# EAGLE design USB_Isolator_v1p00 (EAGLE 9.6.2)
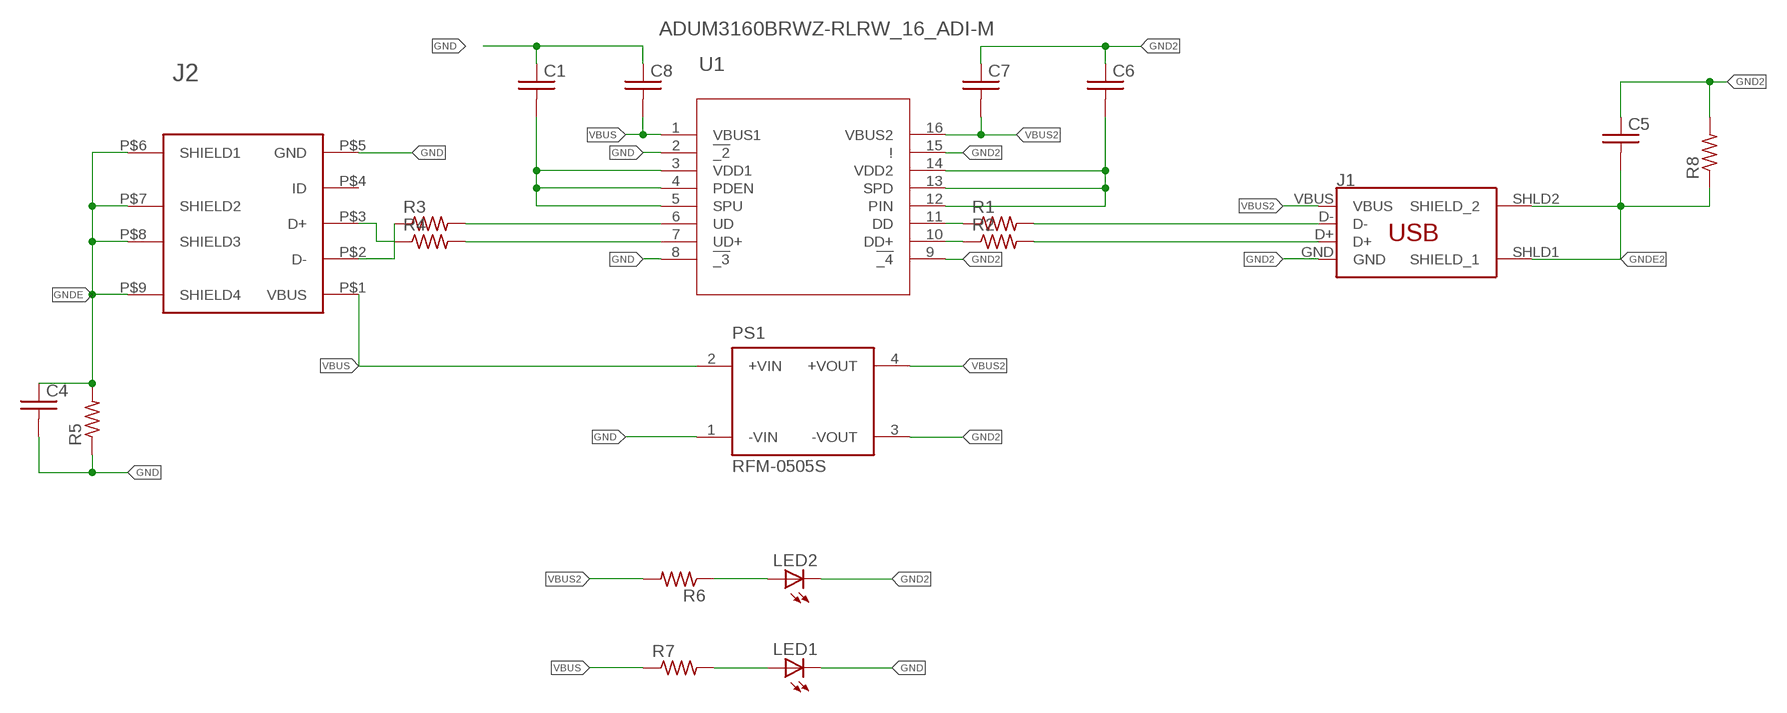
[diagram p0: schematic, sheet 1]

## Parts
C1  C_0402  [0402]
C4  C_0402  [0402]
C5  C_0402  [0402]
C6  C_0402  [0402]
C7  C_0402  [0402]
C8  C_0402  [0402]
J1  USB_A  [USB_A_SMT]
J2  USB_MICRO-B  [USB_MICRO-B]
LED1  LED_0805_GREEN  [LED_0805_GREEN]
LED2  LED_0805_GREEN  [LED_0805_GREEN]
PS1  RFM-0505S  [CONV_RFM-0505S]
R1  R_0402  [0402]
R2  R_0402  [0402]
R3  R_0402  [0402]
R4  R_0402  [0402]
R5  R_0402  [0402]
R6  R_0402  [0402]
R7  R_0402  [0402]
R8  R_0402  [0402]
U1  ADUM3160BRWZ-RLRW_16_ADI-M  [RW_16_ADI-M]

## Nets
GND: C1.P$1 C4.P$2 C8.P$1 J2.P$5(GND) LED1.C PS1.1(-VIN) R5.P$1 U1.2(!_2) U1.8(!_3)
GND2: C5.P$1 C6.P$1 C7.P$1 J1.GND LED2.C PS1.3(-VOUT) R8.P$2 U1.9(!_4) U1.15(!)
GNDE: C4.P$1 J2.P$6(SHIELD1) J2.P$7(SHIELD2) J2.P$8(SHIELD3) J2.P$9(SHIELD4) R5.P$2
GNDE2: C5.P$2 J1.SHLD1(SHIELD_1) J1.SHLD2(SHIELD_2) R8.P$1
N$1: R3.P$2 U1.6(UD)
N$2: R4.P$2 U1.7(UD+)
N$3: R1.P$1 U1.11(DD)
N$4: R2.P$1 U1.10(DD+)
N$5: J2.P$3(D+) R4.P$1
N$6: J2.P$2(D-) R3.P$1
N$7: LED2.A R6.P$1
N$8: J1.D+ R2.P$2
N$9: J1.D- R1.P$2
N$10: C6.P$2 U1.12(PIN) U1.13(SPD) U1.14(VDD2)
N$11: C1.P$2 U1.3(VDD1) U1.4(PDEN) U1.5(SPU)
N$12: LED1.A R7.P$2
VBUS: C8.P$2 J2.P$1(VBUS) PS1.2(+VIN) R7.P$1 U1.1(VBUS1)
VBUS2: C7.P$2 J1.VBUS PS1.4(+VOUT) R6.P$2 U1.16(VBUS2)
Unconnected: J2.P$4(ID)

## Library data of the parts
C1 C4-C8 = 3D_MIG_Controller:C_0402
J1 = 3D_MIG_Controller:USB_A: USB-A Connector Male and female variants, as well as PTH and SMT variants SparkFun Products: SparkFun XBee Explorer Dongle <https://www.sparkfun.com/products/11697> PTH Male SparkFun MicroView-USB Programmer <https://www.sparkfun.com/products/12924> SMT Male SparkFun USB Type A Female Breakout <https://www.sparkfun.com/products/12700> SMT Female
J2 = 3D_MIG_Controller:USB_MICRO-B
LED1 LED2 = 3D_MIG_Controller:LED_0805_GREEN
PS1 = 3D_MIG_Controller:RFM-0505S: DC/DC Converter, 1 Watt, SIP4, Single Output; DESCRIPTION: 1W DC/DC-Converter 'ECONOLINE' SIP4 1kV unreg; DIGI-KEY_PART_NUMBER: 945-3159-ND; DIGIKEY-PURCHASE-URL: https://snapeda.com/shop?store=DigiKey&id=2771046; MF: Recom Power; MOUSER-PURCHASE-URL: https://snapeda.com/shop?store=Mouser&id=2771046; MP: RFM-0505S; PACKAGE: SIP-4 Recom Power
R1-R8 = 3D_MIG_Controller:R_0402
U1 = 3D_MIG_Controller:ADUM3160BRWZ-RL; BUILT_BY: EMA_UL_Team; COPYRIGHT: Copyright (C) 2018 Accelerated Designs. All rights reserved; MANUFACTURER_PART_NUMBER: ADUM3160BRWZ-RL; SOURCELIBRARY: Analog_2019-03-08; VENDOR: Analog Devices Inc

## Board
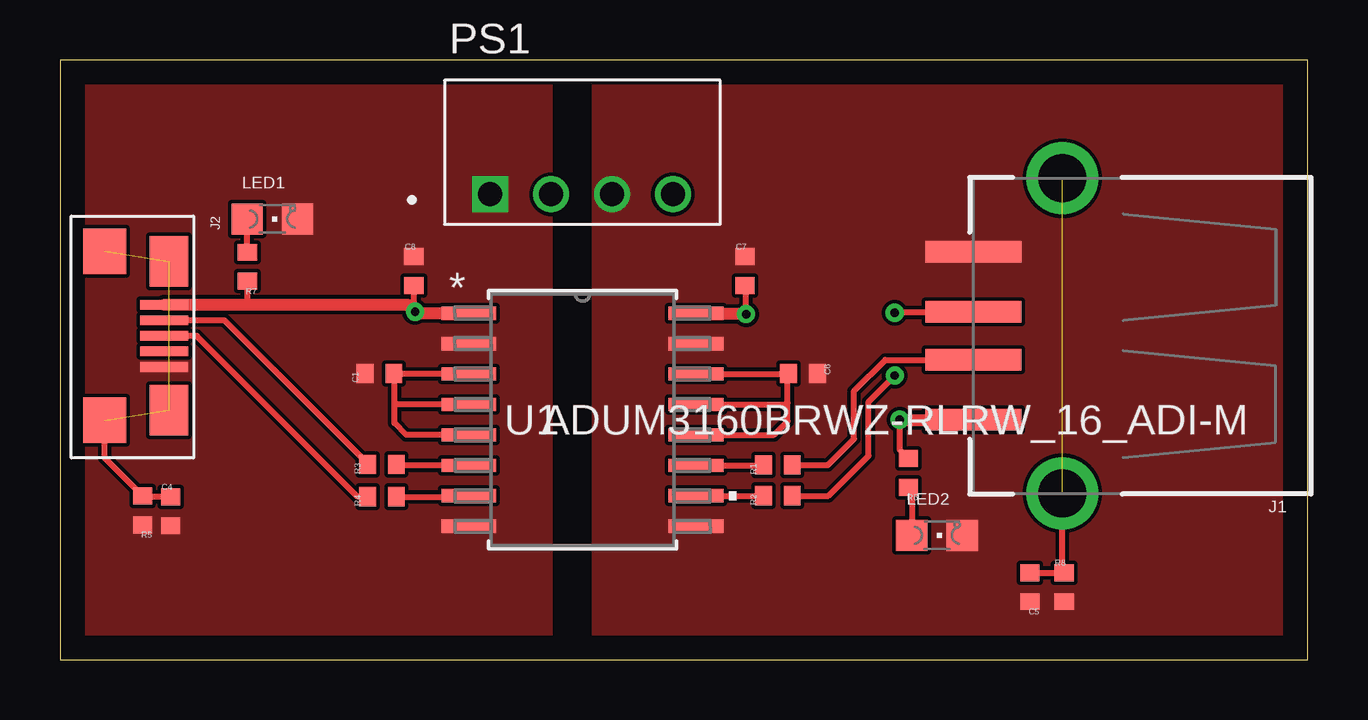
[diagram p1: board, top side]
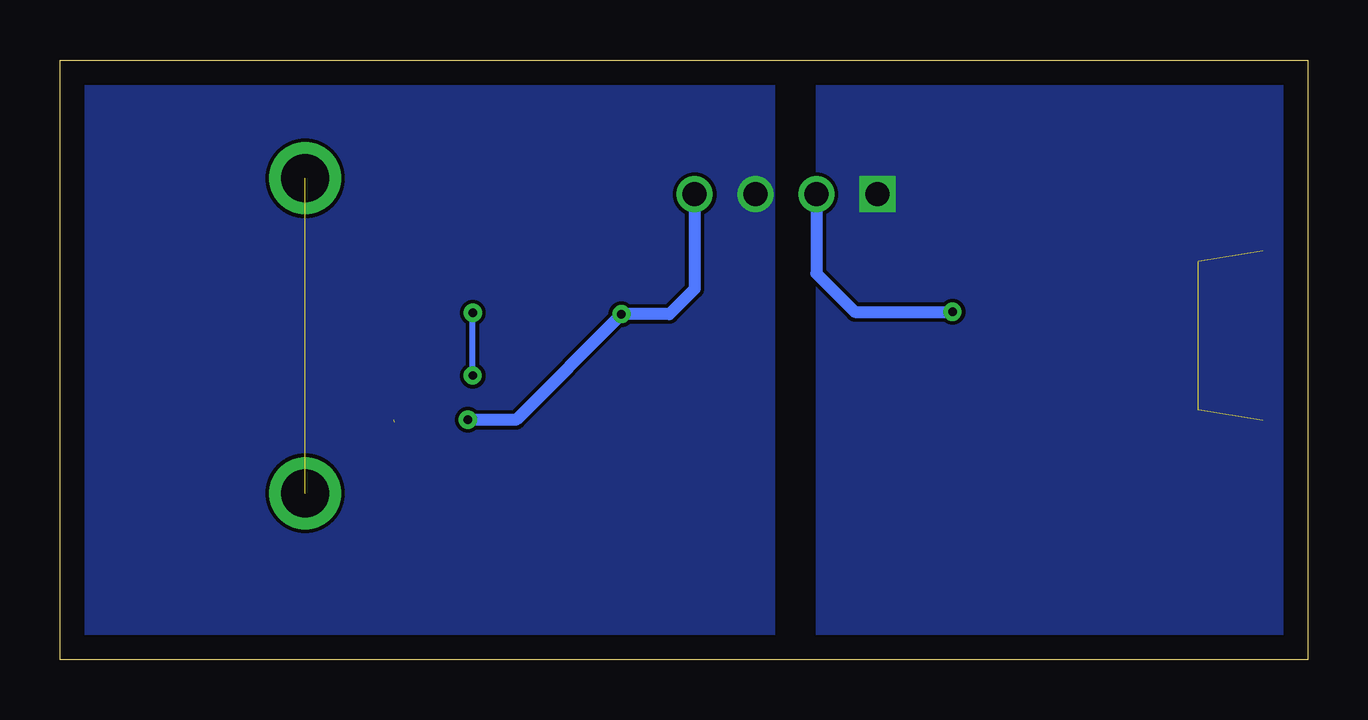
[diagram p2: board, bottom side, seen from below]

Size 52 x 25 mm. Coordinates in mm from the lower left corner, seen from the top.
Outline: 0,0 52,0 52,25 0,25 0,0
Copper layers (1*16): Top 0.035mm / dielectric 1.5mm / Bottom 0.035mm
Design rules "default": minimum track width 6mil, minimum drill 0.35mm, track to track 6mil, track to pad 6mil, pad to pad 6mil, via to via 6mil, smd to smd 6mil, copper to edge 40mil, drill to drill 6mil, minimum pad ring 10mil, minimum via ring 8mil, stop-mask expansion 4mil, vias tented up to drill 0mil, thermal gap 10mil

### Footprints (pad centres in the part's own frame; a part is rotated, then mirrored left to right if it is on the bottom)
0402 = smd 0.8 x 0.7: P$1 0,0.6; P$2 0,-0.6
USB_A_SMT = smd 4 x 0.9: D+ 6.7,-1; D- 6.7,1; GND 6.7,-3.5; VBUS 6.7,3.5 | drill 2: SHLD1 3,-6.566; SHLD2 3,6.566
USB_MICRO-B = smd 0.4 x 2: P$1 -1.3,2.475; P$2 -0.65,2.475; P$3 0,2.475; P$4 0.65,2.475; P$5 1.3,2.475 | smd 2.1 x 1.6: P$6 -3.1,2.675; P$7 3.1,2.675 | smd 1.9 x 1.8: P$8 -3.525,0; P$9 3.525,0
LED_0805_GREEN = smd 1.3 x 1.3: A 0,-1.05; C 0,1.05
CONV_RFM-0505S = drill 1 square: 1 -3.85,-1.75 | drill 1: 2 -1.31,-1.75; 3 1.23,-1.75; 4 3.77,-1.75
RW_16_ADI-M = smd 2.286 x 0.559: 1 -4.737,4.445; 2 -4.737,3.175; 3 -4.737,1.905; 4 -4.737,0.635; 5 -4.737,-0.635; 6 -4.737,-1.905; 7 -4.737,-3.175; 8 -4.737,-4.445; 9 4.737,-4.445; 10 4.737,-3.175; 11 4.737,-1.905; 12 4.737,-0.635; 13 4.737,0.635; 14 4.737,1.905; 15 4.737,3.175; 16 4.737,4.445

### Placement (x,y rotation side)
C1  13.32,11.93 90 top
C4  4.61,6.18 0 top
C5  40.43,3.02 180 top
C6  30.97,11.93 270 top
C7  28.55,16.2 0 top
C8  14.75,16.2 0 top
J1  44.78,13.5 180 top
J2  1.87,13.5 270 top
LED1  8.85,18.37 270 top
LED2  36.55,5.18 270 top
PS1  21.78,21.15 0 top
R1  29.92,8.11 90 top
R2  29.92,6.83 90 top
R3  13.42,8.13 90 top
R4  13.42,6.79 90 top
R5  3.45,6.22 180 top
R6  35.37,7.78 180 top
R7  7.81,16.38 180 top
R8  41.85,3.02 0 top
U1  21.78,10 0 top

### Tracks (layer width: path | path; a pad name or v marks a point on that pad's centre or on a via)
GND
  pour Top (no thermals): 0,25 20.5,25 20.5,0 0,0
  pour Bottom (no thermals): 0,25 20.5,25 20.5,0 0,0
GND2
  pour Top (no thermals): 52,25 52,0 22.2,0 22.2,25
  pour Bottom (no thermals): 22.2,25 52,25 52,0 22.2,0
GNDE  (3 unrouted)
  Top 0.254: C4.P$1 3.49,6.78 R5.P$2 1.87,8.4 J2.P$9
GNDE2  (1 unrouted)
  Top 0.254: C5.P$2 R8.P$1 41.78,3.69 J1.SHLD2
N$1
  Top 0.254: U1.6 14.05,8.1 R3.P$2
N$2
  Top 0.254: R4.P$2 17.01,6.79 U1.7
N$3
  Top 0.254: U1.11 29.3,8.1 R1.P$1
N$4
  Top 0.254: U1.10 R2.P$1
N$5
  Top 0.254: R4.P$1 12.41,6.79 5.7,13.5 J2.P$3
N$6
  Top 0.254: J2.P$2 6.85,14.15 12.82,8.18 R3.P$1
N$7
  Top 0.254: R6.P$1 35.5,7.05 LED2.A
N$8  (via drill 0.35)
  Top 0.254: R2.P$2 32.03,6.83 33.7,8.5 33.7,10.74 v34.8,11.84 | J1.D+ 38.04,14.46 v34.79,14.46
  Bottom 0.254: v34.8,11.84 v34.8,14.45 v34.79,14.46
N$9
  Top 0.254: 37.98,12.24 J1.D- 34.4,12.5 33.1,11.2 33.1,9.2 32.01,8.11 R1.P$2
N$10
  Top 0.254: U1.12 29.77,9.37 30.33,9.93 30.33,10.7 | 30.33,10.7 30.33,11.9 | 30.33,11.9 C6.P$2 | U1.13 30.27,10.63 30.33,10.7 | U1.14 30.32,11.9 30.33,11.9
N$11
  Top 0.254: U1.3 13.95,11.9 | 13.95,11.9 C1.P$2 | U1.5 14.44,9.37 13.95,9.86 13.95,10.6 | 13.95,10.6 13.95,11.9 | U1.4 13.98,10.63 13.95,10.6
N$12
  Top 0.254: R7.P$2 LED1.A
VBUS  (via drill 0.35)
  Top 0.254: v14.8,14.5 14.75,14.55 C8.P$2 | R7.P$1 7.81,14.81 7.8,14.8
  Top 0.508: J2.P$1 7.8,14.8 14.5,14.8 v14.8,14.5 14.86,14.45 U1.1
  Bottom 0.508: PS1.2 20.47,16.1 18.87,14.5 v14.8,14.5
VBUS2  (via drill 0.35)  (1 unrouted)
  Top 0.254: 37.98,9.74 J1.VBUS | R6.P$2 35,8.75 v35,10 | v28.6,14.4 28.6,15.5 C7.P$2
  Top 0.508: v28.6,14.4 26.56,14.4 U1.16 | v35,10 37.95,10 38.04,9.91
  Bottom 0.508: PS1.4 25.55,15.45 26.6,14.4 v28.6,14.4 33,10 v35,10